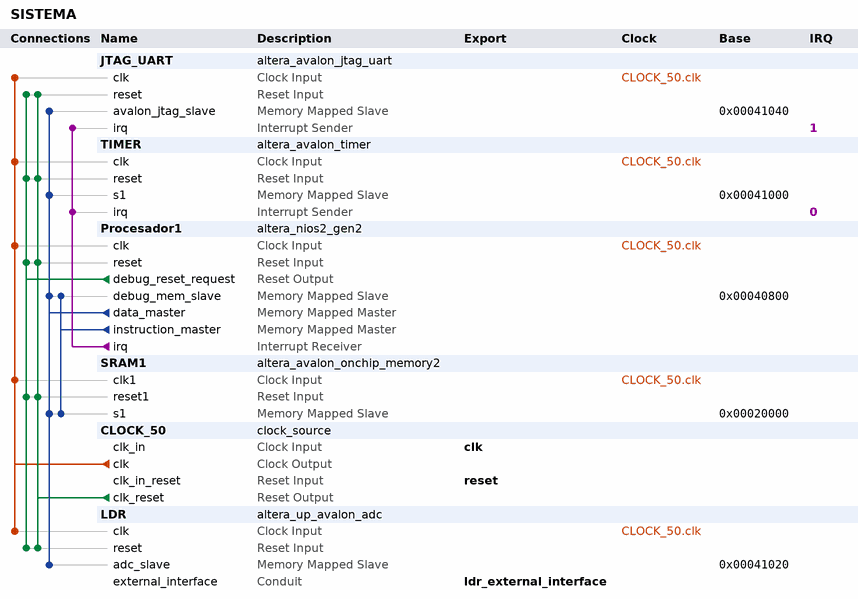
[diagram p0: system contents]
# Platform Designer (Qsys) system SISTEMA, Cyclone V 5CSXFC6D6F31C6
# Parameters at their usual value, and those the tool derives, are not listed.
package require -exact qsys 17.0
create_system SISTEMA
set_project_property DEVICE_FAMILY {Cyclone V}
set_project_property DEVICE 5CSXFC6D6F31C6

add_instance JTAG_UART altera_avalon_jtag_uart 17.0
set_instance_parameter_value JTAG_UART simInteractiveOptions NO_INTERACTIVE_WINDOWS

add_instance TIMER altera_avalon_timer 17.0
set_instance_parameter_value TIMER period 1
set_instance_parameter_value TIMER periodUnits MSEC

add_instance Procesador1 altera_nios2_gen2 17.0
set_instance_parameter_value Procesador1 cpuID 1
set_instance_parameter_value Procesador1 dcache_size 2048
set_instance_parameter_value Procesador1 exceptionSlave SRAM1.s1
set_instance_parameter_value Procesador1 icache_size 4096
set_instance_parameter_value Procesador1 impl Fast
set_instance_parameter_value Procesador1 resetSlave SRAM1.s1

add_instance SRAM1 altera_avalon_onchip_memory2 17.0
set_instance_parameter_value SRAM1 dataWidth 128
set_instance_parameter_value SRAM1 dualPort false
set_instance_parameter_value SRAM1 initMemContent true
set_instance_parameter_value SRAM1 initializationFileName onchip_mem.hex
set_instance_parameter_value SRAM1 memorySize 128000

add_instance CLOCK_50 clock_source 17.0
set_instance_parameter_value CLOCK_50 clockFrequency 50000000

add_instance LDR altera_up_avalon_adc 17.0
set_instance_parameter_value LDR board DE1-SoC
set_instance_parameter_value LDR numch_ 4

# connections
add_connection CLOCK_50.clk JTAG_UART.clk clock
add_connection CLOCK_50.clk LDR.clk clock
add_connection CLOCK_50.clk Procesador1.clk clock
add_connection CLOCK_50.clk SRAM1.clk1 clock
add_connection CLOCK_50.clk TIMER.clk clock
add_connection CLOCK_50.clk_reset JTAG_UART.reset reset
add_connection CLOCK_50.clk_reset LDR.reset reset
add_connection CLOCK_50.clk_reset Procesador1.reset reset
add_connection CLOCK_50.clk_reset SRAM1.reset1 reset
add_connection CLOCK_50.clk_reset TIMER.reset reset
add_connection Procesador1.debug_reset_request JTAG_UART.reset reset
add_connection Procesador1.debug_reset_request LDR.reset reset
add_connection Procesador1.debug_reset_request Procesador1.reset reset
add_connection Procesador1.debug_reset_request SRAM1.reset1 reset
add_connection Procesador1.debug_reset_request TIMER.reset reset
add_connection Procesador1.data_master JTAG_UART.avalon_jtag_slave avalon
set_connection_parameter_value Procesador1.data_master/JTAG_UART.avalon_jtag_slave baseAddress 0x00041040
add_connection Procesador1.data_master LDR.adc_slave avalon
set_connection_parameter_value Procesador1.data_master/LDR.adc_slave baseAddress 0x00041020
add_connection Procesador1.data_master Procesador1.debug_mem_slave avalon
set_connection_parameter_value Procesador1.data_master/Procesador1.debug_mem_slave baseAddress 0x00040800
add_connection Procesador1.data_master SRAM1.s1 avalon
set_connection_parameter_value Procesador1.data_master/SRAM1.s1 baseAddress 0x00020000
add_connection Procesador1.data_master TIMER.s1 avalon
set_connection_parameter_value Procesador1.data_master/TIMER.s1 baseAddress 0x00041000
add_connection Procesador1.instruction_master Procesador1.debug_mem_slave avalon
set_connection_parameter_value Procesador1.instruction_master/Procesador1.debug_mem_slave baseAddress 0x00040800
add_connection Procesador1.instruction_master SRAM1.s1 avalon
set_connection_parameter_value Procesador1.instruction_master/SRAM1.s1 baseAddress 0x00020000
add_connection Procesador1.irq JTAG_UART.irq interrupt
set_connection_parameter_value Procesador1.irq/JTAG_UART.irq irqNumber 1
add_connection Procesador1.irq TIMER.irq interrupt
set_connection_parameter_value Procesador1.irq/TIMER.irq irqNumber 0

# exported interfaces
add_interface clk clock sink
set_interface_property clk EXPORT_OF CLOCK_50.clk_in
add_interface ldr_external_interface conduit end
set_interface_property ldr_external_interface EXPORT_OF LDR.external_interface
add_interface reset reset sink
set_interface_property reset EXPORT_OF CLOCK_50.clk_in_reset

set_interconnect_requirement {$system} qsys_mm.clockCrossingAdapter HANDSHAKE
set_interconnect_requirement {$system} qsys_mm.enableEccProtection FALSE
set_interconnect_requirement {$system} qsys_mm.insertDefaultSlave FALSE
set_interconnect_requirement {$system} qsys_mm.maxAdditionalLatency 1

save_system SISTEMA.qsys
